# EAGLE design Hermes v1 (EAGLE 7.5.0)
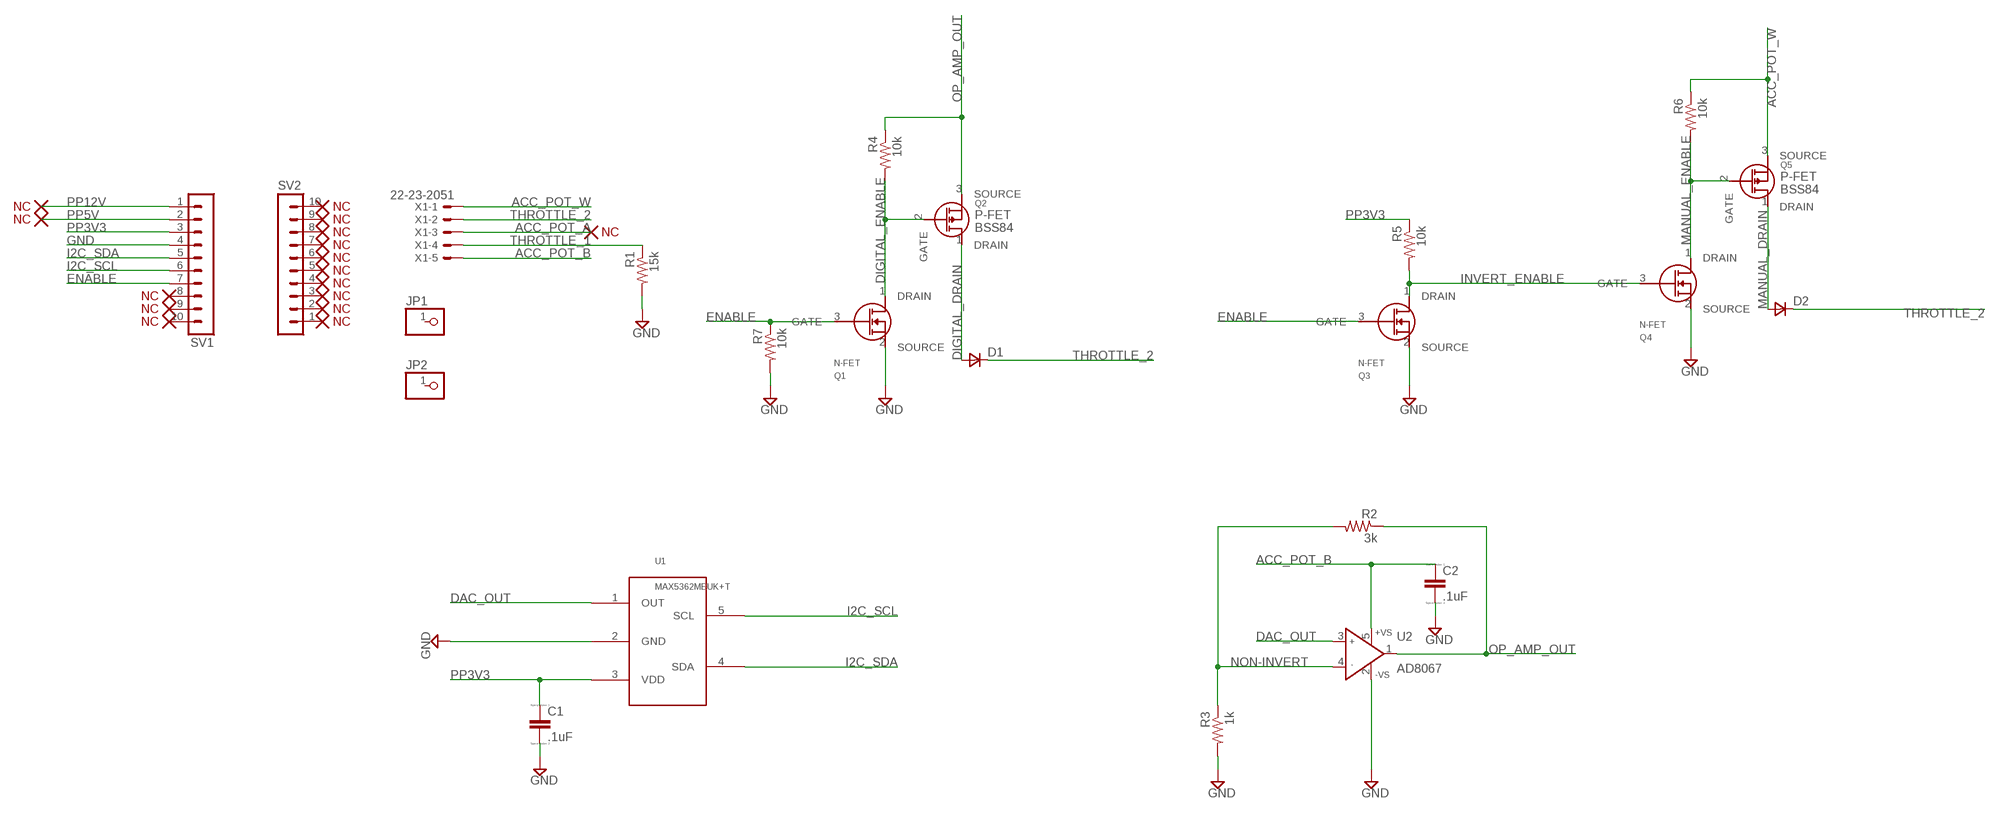
[diagram p0: schematic, sheet 1]

## Parts
C1  .1uF  CC0402  [C0402]
C2  .1uF  CC0402  [C0402]
D1  DSOD323  [SOD323]
D2  DSOD323  [SOD323]
JP1  PINHD-1X1  [1X01]
JP2  PINHD-1X1  [1X01]
Q1  NMOSFET  [SOT-23]
Q2  P-FET  [SOT-23]
Q3  NMOSFET  [SOT-23]
Q4  NMOSFET  [SOT-23]
Q5  P-FET  [SOT-23]
R1  15k  R-US_R0603  [R0603]
R2  3k  R-US_R0603  [R0603]
R3  1k  R-US_R0603  [R0603]
R4  10k  R-US_R0603  [R0603]
R5  10k  R-US_R0603  [R0603]
R6  10k  R-US_R0603  [R0603]
R7  10k  R-US_R0603  [R0603]
SV1  MA10-1  [MA10-1]
SV2  MA10-1  [MA10-1]
U1  DAC  [SOT23-5]
U2  AD8067  [SOT23-5]
X1  22-23-2051  [22-23-2051]

## Nets
ACC_POT_A: X1.3
ACC_POT_B: C2.1 U2.5(+VS) X1.5
ACC_POT_W: Q5.3(SOURCE) R6.1 X1.1
DAC_OUT: U1.1(OUT) U2.3(IN+)
DIGITAL_DRAIN: D1.2(A) Q2.1(DRAIN)
DIGITAL_ENABLE: Q1.1(DRAIN) Q2.2(GATE) R4.2
ENABLE: Q1.3(GATE) Q3.3(GATE) R7.1 SV1.7
GND: C1.2 C2.2 Q1.2(SOURCE) Q3.2(SOURCE) Q4.2(SOURCE) R1.2 R3.2 R7.2 SV1.4 U1.2(GND) U2.2(-VS)
I2C_SCL: SV1.6 U1.5(SCL)
I2C_SDA: SV1.5 U1.4(SDA)
INVERT_ENABLE: Q3.1(DRAIN) Q4.3(GATE) R5.2
MANUAL_DRAIN: D2.2(A) Q5.1(DRAIN)
MANUAL_ENABLE: Q4.1(DRAIN) Q5.2(GATE) R6.2
NON-INVERT: R2.2 R3.1 U2.4(IN-)
OP_AMP_OUT: Q2.3(SOURCE) R2.1 R4.1 U2.1(OUT)
PP3V3: C1.1 R5.1 SV1.3 U1.3(VDD)
PP5V: SV1.2
PP12V: SV1.1
THROTTLE_1: R1.1 X1.4
THROTTLE_2: D1.1(C) D2.1(C) X1.2
Unconnected: JP1.1 JP2.1 SV1.8 SV1.9 SV1.10 SV2.1 SV2.2 SV2.3 SV2.4 SV2.5 SV2.6 SV2.7 SV2.8 SV2.9 SV2.10

## Library data of the parts
C1 C2 = eagle-ltspice:C: CAPACITOR, European symbol; SPICEMODEL: NONE; SPICEPREFIX: C
D1 = zetex:D: DIODE; DIGI: BAT54WS-FDICT-ND; MPN: CDSOD323-T05C; OC_FARNELL: 1824860; OC_NEWARK: 79R6078
D2 = zetex:D: DIODE; MPN: CDSOD323-T05C; OC_FARNELL: 1824860; OC_NEWARK: 79R6078
JP1 JP2 = pinhead:PINHD-1X1: PIN HEADER
Q1 Q3 Q4 = N-FET:NMOSFET: N-FET transistor SOT-23; DIGI: BSS138CT-ND
Q2 Q5 = P-FET:P-FET; DIGI: BSS84CT-ND
R1-R7 = resistor:R-US_: RESISTOR, American symbol
SV1 SV2 = con-lstb:MA10-1: PIN HEADER; OC_FARNELL: unknown; OC_NEWARK: unknown
U1 = DAC:DAC; DIGI: MAX5362MEUK+TCT-ND
U2 = analog-devices:AD8067: High Gain Bandwidth, Precision Fast FET(TM) Op Amp Source: http://www.analog.com/UploadedFiles/Data_Sheets/346131962AD8067_a.pdf; DIGI: 497-13051-1-ND; MF: ALTERA CORPORATION; MPN: AD8067ARTZ-REEL7; OC_FARNELL: 1464848; OC_NEWARK: 59K6326
X1 = con-molex:22-23-2051: .100" (2.54mm) Center Header - 5 Pin; MF: MOLEX; MPN: 22-23-2051; OC_FARNELL: 1462952; OC_NEWARK: 38C9178

## Board
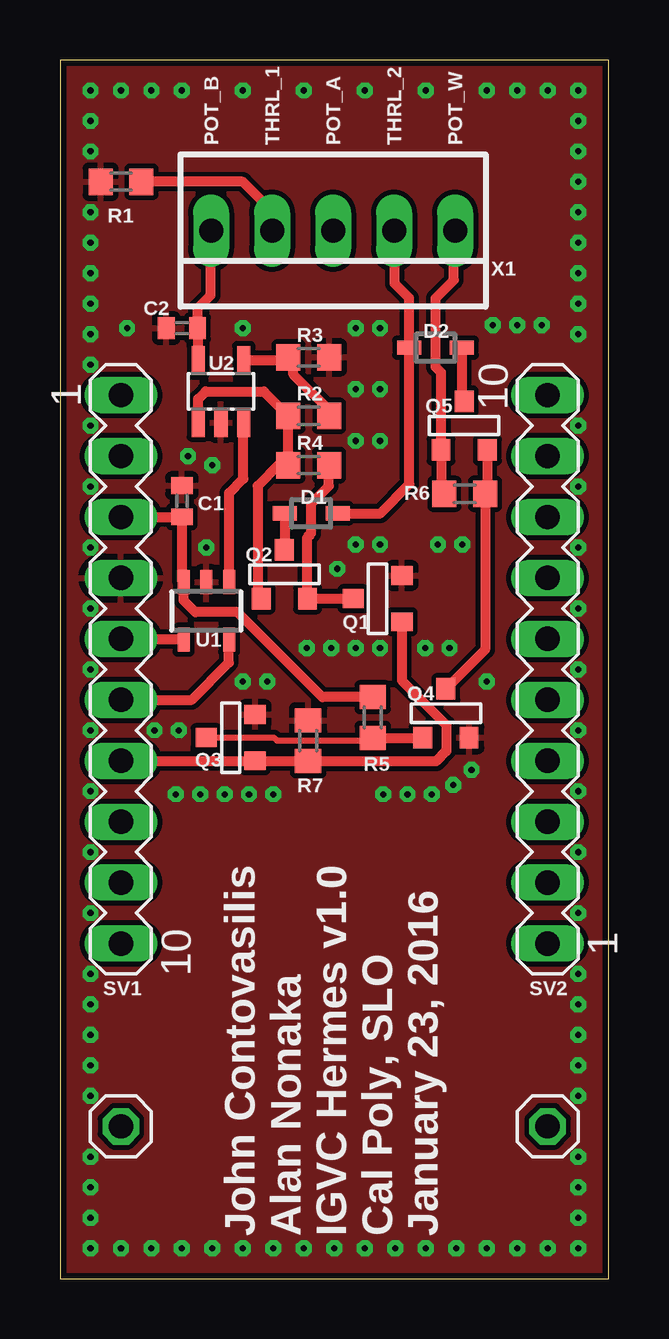
[diagram p1: board, top side]
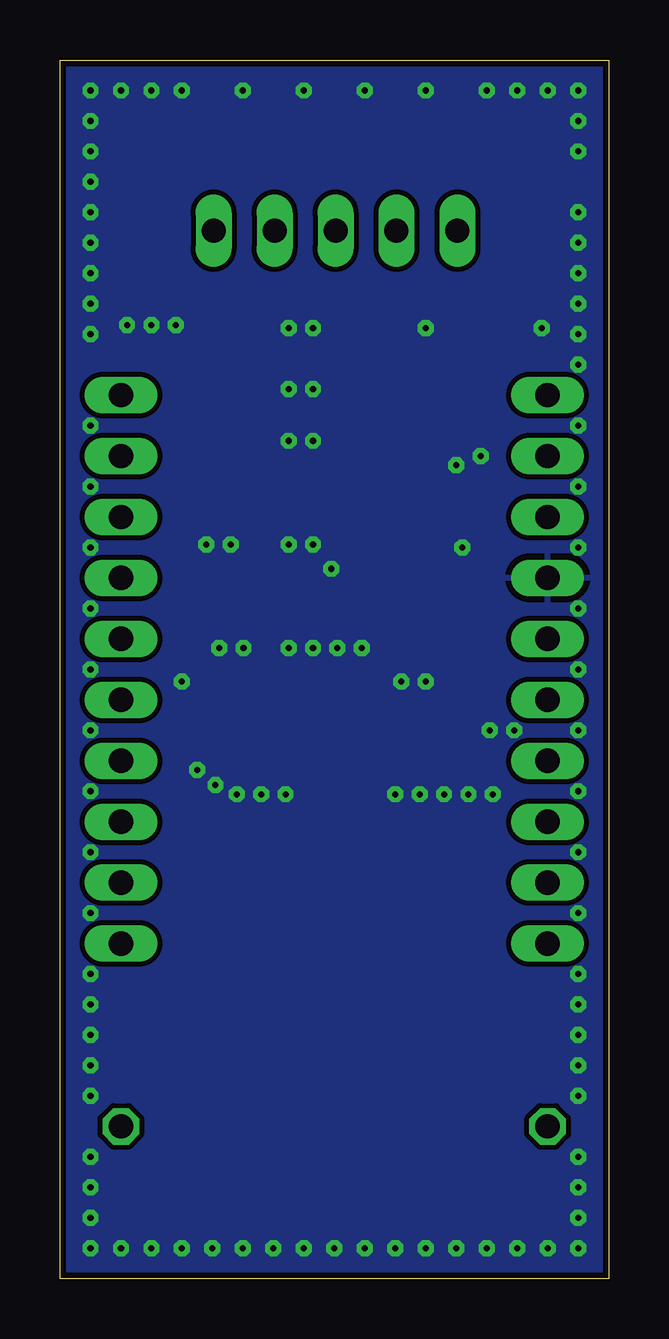
[diagram p2: board, bottom side, seen from below]

Size 22.86 x 50.8 mm. Coordinates in mm from the lower left corner, seen from the top.
Outline: 0,0 22.86,0 22.86,50.8 0,50.8 0,0
Copper layers (1*16): Top 0.035mm / dielectric 1.5mm / Bottom 0.035mm
Design rules "default *": minimum track width 10mil, minimum drill 10mil, track to track 8mil, track to pad 8mil, pad to pad 8mil, via to via 8mil, smd to smd 8mil, copper to edge 10mil, drill to drill 8mil, minimum pad ring 10mil, minimum via ring 8mil, stop-mask expansion 0mil, vias tented up to drill 0mil, thermal gap 10mil

### Footprints (pad centres in the part's own frame; a part is rotated, then mirrored left to right if it is on the bottom)
C0402 = smd 0.7 x 0.9: 1 -0.65,0; 2 0.65,0
SOD323 = smd 1 x 0.6: 1 -1.1,0; 2 1.1,0
1X01 = drill 1.016 octagon: 1 0,0
SOT-23 = smd 0.787 x 0.889: 1 0.025,-1.016; 2 -0.94,1.016; 3 0.991,1.016
R0603 = smd 1 x 1.1: 1 -0.85,0; 2 0.85,0
MA10-1 = drill 1.016 long: 1 -11.43,0; 2 -8.89,0; 3 -6.35,0; 4 -3.81,0; 5 -1.27,0; 6 1.27,0; 7 3.81,0; 8 6.35,0; 9 8.89,0; 10 11.43,0
SOT23-5 = smd 0.5 x 1: 1 -0.95,-1.2; 2 0,-1.2; 3 0.95,-1.2; 4 0.95,1.2; 5 -0.95,1.2
SOT23-5' = smd 0.55 x 1.2: 1 -0.95,-1.3; 2 0,-1.3; 3 0.95,-1.3; 4 0.95,1.3; 5 -0.95,1.3
22-23-2051 = drill 1 long: 1 -5.08,0; 2 -2.54,0; 3 0,0; 4 2.54,0; 5 5.08,0

### Placement (x,y rotation side)
C1  5.08,32.41 90 top
C2  5.08,39.62 180 top
D1  10.46,31.9 180 top
D2  15.65,38.81 0 top
JP1  2.54,6.35 0 top
JP2  20.32,6.35 0 top
Q1  13.23,28.37 270 top
Q2  9.37,29.36 180 top
Q3  7.11,22.58 270 top
Q4  16.1,23.57 180 top
Q5  16.87,35.56 180 top
R1  2.54,45.72 180 top
R2  10.36,35.97 0 top
R3  10.36,38.4 0 top
R4  10.36,33.91 0 top
R5  13.03,23.39 270 top
R6  16.87,32.72 0 top
R7  10.34,22.43 90 top
SV1  2.54,25.4 270 top
SV2  20.32,25.4 90 top
U1  6.1,27.84 180 top
U2  AD8067  [SOT23-5']  6.71,36.98 0 top
X1  11.38,43.69 180 top

### Tracks (layer width: path | path; a pad name or v marks a point on that pad's centre or on a via)
ACC_POT_B
  Top 0.406: U2.5 5.76,39.6 C2.1 5.73,40.45 6.27,41 6.27,43.66 X1.5
ACC_POT_W
  Top 0.406: R6.1 15.88,32.86 Q5.3 15.88,37.77 15.65,38 15.65,40.87 16.41,41.63 16.41,43.64 X1.1
DAC_OUT
  Top 0.406: U1.1 7.05,32.75 7.64,33.35 7.64,35.67 U2.3
DIGITAL_DRAIN
  Top 0.406: D1.2 9.37,30.36 Q2.1
DIGITAL_ENABLE
  Top 0.406: Q1.1 Q2.2 10.31,30.91 10.46,31.06 10.46,32.31 11.2,33.05 11.2,33.9 R4.2
ENABLE
  Top 0.406: SV1.7 Q3.3 10.33,21.59 R7.1 10.35,21.57 15.67,21.57 16.1,22 16.1,23.09 14.25,24.94 Q1.3
GND  (via drill 0.25)
  other vias: 7.62,24.89 4.95,22.86 6.35,33.91 17.14,21.21 2.79,39.62 7.62,39.62 12.32,39.62 13.34,39.62 18.03,39.75 19.05,39.75 20.07,39.75 12.32,37.08 13.34,37.08 12.32,34.92 13.34,34.92 11.56,29.59 12.32,30.61 13.34,30.61 15.75,30.61 16.76,30.61 6.1,30.48 10.29,26.29 11.3,26.29 12.32,26.29 13.34,26.29 15.21,26.29 16.23,26.29 8.64,24.89 3.94,22.86 4.83,20.19 5.84,20.19 6.86,20.19 7.87,20.19 8.89,20.19 16.38,20.57 13.46,20.19 14.48,20.19 15.49,20.19 17.78,24.89 5.33,34.29 1.27,35.56 1.27,38.1 1.27,39.37 1.27,40.64 1.27,41.91 1.27,43.18 1.27,44.45 1.27,46.99 1.27,48.26 1.27,49.53 2.54,49.53 3.81,49.53 5.08,49.53 7.62,49.53 10.16,49.53 12.7,49.53 15.24,49.53 17.78,49.53 19.05,49.53 20.32,49.53 21.59,49.53 21.59,48.26 21.59,46.99 21.59,45.72 21.59,44.45 21.59,43.18 21.59,41.91 21.59,40.64 21.59,39.37 21.59,35.56 21.59,33.02 21.59,30.48 21.59,27.94 21.59,25.4 21.59,22.86 21.59,20.32 21.59,17.78 21.59,15.24 21.59,12.7 21.59,11.43 21.59,10.16 21.59,8.89 21.59,7.62 21.59,5.08 21.59,3.81 21.59,2.54 21.59,1.27 20.32,1.27 19.05,1.27 17.78,1.27 16.51,1.27 15.24,1.27 13.97,1.27 12.7,1.27 11.43,1.27 10.16,1.27 8.89,1.27 7.62,1.27 6.35,1.27 5.08,1.27 3.81,1.27 2.54,1.27 1.27,1.27 1.27,2.54 1.27,3.81 1.27,5.08 1.27,7.62 1.27,8.89 1.27,10.16 1.27,11.43 1.27,12.7 1.27,15.24 1.27,17.78 1.27,20.32 1.27,22.86 1.27,25.4 1.27,27.94 1.27,30.48 1.27,33.02
  pour Top: 0,50.8 22.86,50.8 22.86,50.37 22.86,0 0,0
  pour Bottom: 0,50.8 0,0 22.86,0 22.86,50.8
I2C_SCL
  Top 0.406: SV1.6 5.49,24.13 7.04,25.68 7.04,26.63 U1.5
I2C_SDA
  Top 0.406: SV1.5 5.11,26.67 U1.4
INVERT_ENABLE
  Top 0.254: Q3.1 8.91,22.55 9.04,22.43 12.91,22.43
  Top 0.406: 12.91,22.43 R5.2 15.1,22.54 Q4.3
MANUAL_DRAIN
  Top 0.406: D2.2 16.75,36.67 Q5.1
MANUAL_ENABLE
  Top 0.406: Q5.2 17.8,32.8 R6.2 17.72,26.23 Q4.1
NON-INVERT
  Top 0.406: U2.4 9.39,38.28 R3.1 9.73,38.19 9.73,37.69 11.21,36.21 R2.2
OP_AMP_OUT
  Top 0.406: U2.1 5.76,36.67 6.07,36.98 8.5,36.98 R2.1 R4.1 9.09,33.91 8.23,33.05 8.23,28.5 Q2.3
PP3V3
  Top 0.406: SV1.3 C1.1 5.08,29.1 U1.3 5.16,29.03 5.16,28.27 5.64,27.79 7.39,27.79 10.94,24.24 R5.1
THROTTLE_1
  Top 0.406: X1.4 8.84,44.5 7.62,45.72 R1.1
THROTTLE_2
  Top 0.406: D1.1 13.34,31.9 14.55,33.12 D2.1 14.55,40.88 13.95,41.48 13.95,43.66 X1.2

### Text on the board
tNames: POT_B | THRL_1 | POT_A | THRL_2 | POT_W | John Contovasilis / Alan Nonaka / IGVC Hermes v1.0 / Cal Poly, SLO / January 23, 2016